# Altium schematic sheet TIDA-01576_ADS8686S_ISO_Interface_Pg8-Hardware.SchDoc
size 431 x 279 mm; Date: Not shown in title block; ApprovedBy: Not shown in title block; CheckedBy: Not shown in title block; Author: Not shown in title block; CompanyName: Not shown in title block; Engineer: Not shown in title block; Organization: Not shown in title block; Address1: Not shown in title block; Address2: Not shown in title block; Address3: Not shown in title block; Address4: Not shown in title block; DocumentNumber: 1; Revision: Use project parameter SCH_Rev; SheetNumber: 8; SheetTotal: 8; PageSetup: Record=PageOptions|CenterHorizontal=True|CenterVertical=True|PrintScale=1.00|XCorrection=1.00|YCorrection=1.00|PrintKind=0|BorderSize=5000000|LeftOffset=0|BottomOffset=0|Orientation=2|PaperLength=1000|PaperWidth=1000|Scale=100|PaperSource=15|PrintQuality=600|MediaType=1|DitherType=10|PaperKind=Letter|PrintScaleMode=1; CurrentTime: Not shown in title block; CurrentDate: Not shown in title block; Time: Not shown in title block; DocumentFullPathAndName: Not shown in title block; DocumentName: Not shown in title block; ModifiedDate: Not shown in title block; ImagePath: Not shown in title block
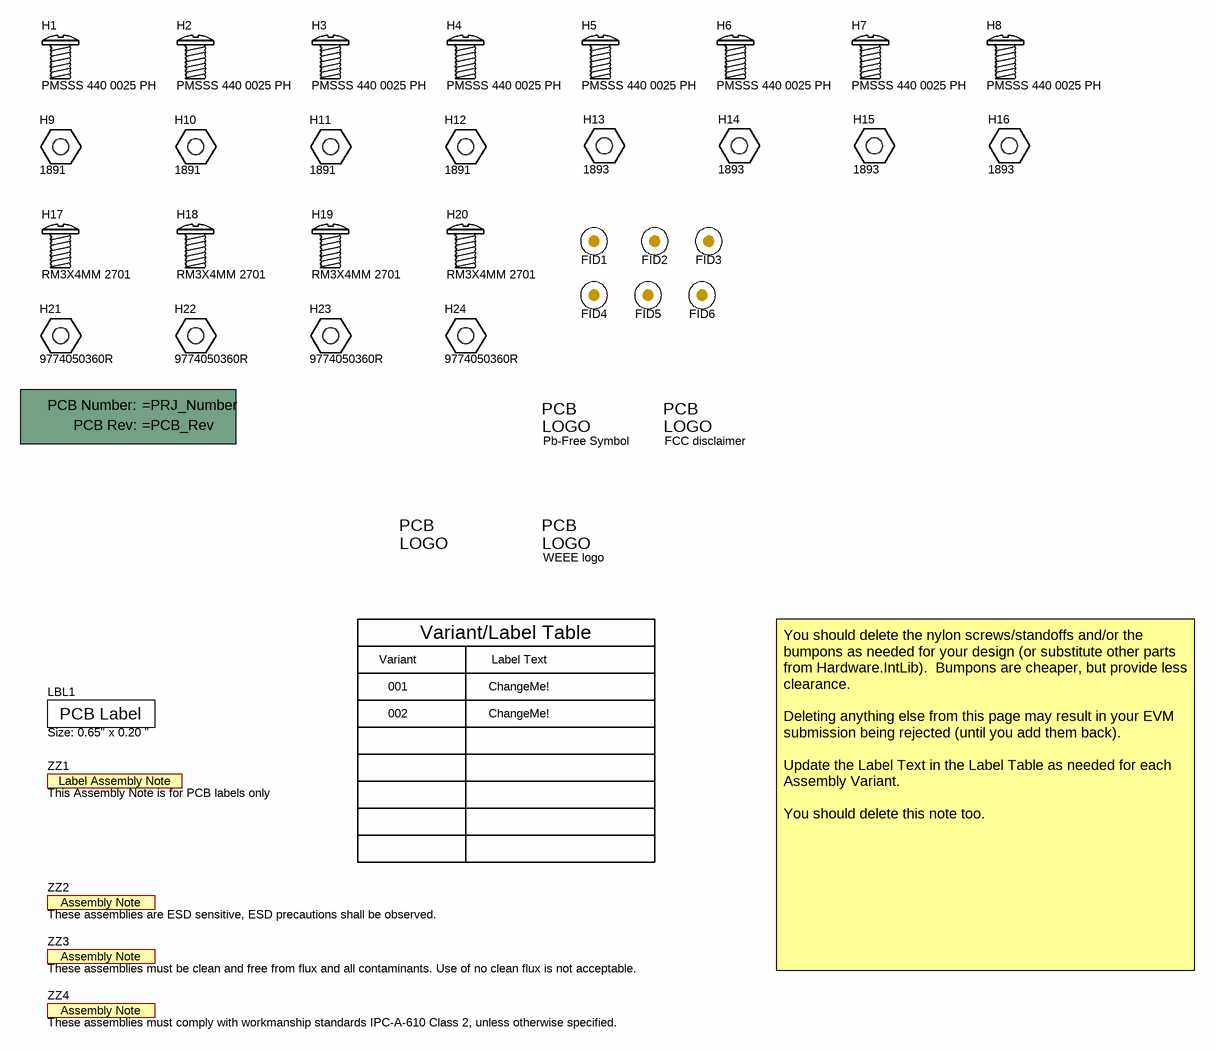
[diagram p0: TIDA-01576_ADS8686S_ISO_Interface_Pg8-Hardware.SchDoc]

## Parts
!PCB1  Printed Circuit Board  (value not drawn)  (mechanical)
FID1  Fiducial  [Fiducial10-20]  (value not drawn)  (no BOM)
FID2  Fiducial  [Fiducial10-20]  (value not drawn)  (no BOM)
FID3  Fiducial  [Fiducial10-20]  (value not drawn)  (no BOM)
FID4  Fiducial  [Fiducial10-20]  (value not drawn)  (no BOM)
FID5  Fiducial  [Fiducial10-20]  (value not drawn)  (no BOM)
FID6  Fiducial  [Fiducial10-20]  (value not drawn)  (no BOM)
H1  PMSSS 440 0025 PH  [B_F_PMSSS4400025PH]
H2  PMSSS 440 0025 PH  [B_F_PMSSS4400025PH]
H3  PMSSS 440 0025 PH  [B_F_PMSSS4400025PH]
H4  PMSSS 440 0025 PH  [B_F_PMSSS4400025PH]
H5  PMSSS 440 0025 PH  [B_F_PMSSS4400025PH]
H6  PMSSS 440 0025 PH  [B_F_PMSSS4400025PH]
H7  PMSSS 440 0025 PH  [B_F_PMSSS4400025PH]
H8  PMSSS 440 0025 PH  [B_F_PMSSS4400025PH]
H9  1891  [Keystone_1891]
H10  1891  [Keystone_1891]
H11  1891  [Keystone_1891]
H12  1891  [Keystone_1891]
H13  1893  [Keystone_1893]
H14  1893  [Keystone_1893]
H15  1893  [Keystone_1893]
H16  1893  [Keystone_1893]
H17  RM3X4MM 2701  (mechanical)
H18  RM3X4MM 2701  (mechanical)
H19  RM3X4MM 2701  (mechanical)
H20  RM3X4MM 2701  (mechanical)
H21  9774050360R  [Wurth_WA-SMSI]
H22  9774050360R  [Wurth_WA-SMSI]
H23  9774050360R  [Wurth_WA-SMSI]
H24  9774050360R  [Wurth_WA-SMSI]
LBL1  Size: 0.65" x 0.20 "  [Label_650x200]
Logo2  Pb-Free Symbol  [Pb-Free_Overlay_Small]  (no BOM)
Logo3  FCC disclaimer  [FCC_disclaimer]  (no BOM)
Logo4  WEEE logo  [WEEE_Minimum]  (no BOM)
Logo5  ESD Susceptible  [ESD_Overlay_small]  (value not drawn)  (no BOM)
ZZ1  This Assembly Note is for PCB labels only  [AssemblyNoteLabel]  (no BOM)
ZZ2  These assemblies are ESD sensitive, ESD precautions shall be observed.  [AssemblyNote]  (no BOM)
ZZ3  These assemblies must be clean and free from flux and all contaminants. Use of no clean flux is not acceptable.  [AssemblyNote]  (no BOM)
ZZ4  These assemblies must comply with workmanship standards IPC-A-610 Class 2, unless otherwise specified.  [AssemblyNote]  (no BOM)

## Notes on the sheet
- Variant
- Variant/Label Table
- Label Text
- 001
- 002
- ChangeMe!
- You should delete the nylon screws/standoffs and/or the bumpons as needed for your design (or substitute other parts from Hardware.IntLib).  Bumpons are cheaper, but provide less clearance.
  Deleting anything else from this page may result in your EVM submission being rejected (until you add them back).
  Update the Label Text in the Label Table as needed for each Assembly Variant.
  You should delete this note too.
- Drawn By:
- SVN Rev:
- Number:
- TID #:
- Orderable:
- Rev:
- Sheet Title:
- File:
- Project Title:
- Designed for:
- Assembly Variant:
- Mod. Date:
- Sheet:
- Size:
- of
- B
- http://www.ti.com
- Texas Instruments and/or its licensors do not warrant the accuracy or completeness of this specification or any information contained therein. Texas Instruments and/or its licensors do not warrant that this design will meet the specifications, will be suitable for your application or fit for any particular purpose, or will operate in an implementation. Texas Instruments and/or its licensors do not warrant that the design is production worthy. You should completely validate and test your design implementation to confirm the system functionality for your application.
- Engineer:
- Contact:
- © Texas Instruments
- (in symbol AssemblyNote) Assembly Note
- (in symbol AssemblyNoteLabel) Label Assembly Note
- (in symbol CMP-0074769-1) PCB; LOGO
- (in symbol ESD_Susceptible) PCB; LOGO
- (in symbol FCC_disclaimer) PCB; LOGO
- (in symbol Pb-Free) PCB; LOGO
- (in symbol PCB) PCB Number:; PCB Rev:
- (in symbol THT-14-423-10) PCB Label

## Library data of the parts
!PCB1 = PCB: Manufacturer: Any; SymbolCreator: a0412235; SymbolVersion: 2012-05-30; CompType: PCB; PartNumber: =PRJ_Number; RoHS: O; MountType: N/A; Publisher: Texas Instruments; LatestRevisionDate: 2012-06-27; LatestRevisionNote: Initial Version; Alternate Manufacturer: -; Alternate PartNumber: -
FID1-FID6 = Fiducial: Fiducial mark.  There is nothing to buy or mount.; SymbolCreator: codlsc; SymbolVersion: 2009-11-4; CompType: Fiducial; Publisher: Texas Instruments; LatestRevisionDate: 2015-06-01; LatestRevisionNote: Added Alternate PartNumber and Alternate Manufacturer parameters to appropriate components.; Manufacturer: N/A; MountType: N/A; PackageReference: N/A; PartNumber: N/A; ClassName: FiducialMark
H1-H8 = PMSSS 440 0025 PH: MACHINE SCREW PAN PHILLIPS 4-40; Manufacturer: B&F Fastener Supply; SymbolCreator: a0412235; CompType: Standoff; SymbolVersion: 2013-06-24; PartNumber: PMSSS 440 0025 PH; RoHS: Y; PackageReference: Machine Screw, 4-40, 1/4"; MountType: TH; ComponentLink1Description: Datasheet Link; ComponentLink1URL: http://www.fasnetdirect.com/refguide/Machinepancombo.pdf; Publisher: Texas Instruments; LatestRevisionDate: 2015-08-24; Supplier 1: Digi-Key; Supplier Part Number 1: H703-ND
H9-H12 = 1891: 3/16 Hex Female Standoff; Manufacturer: Keystone; SymbolCreator: a0412235; SymbolVersion: 2013-06-24; CompType: Standoff; PartNumber: 1891; RoHS: Y; PackageReference: 3/16 Hex Female Standoff; MountType: N/A; ComponentLink1Description: Datasheet Link; ComponentLink1URL: http://www.keyelco.com/product-pdf.cfm?p=4272; Publisher: Texas Instruments; LatestRevisionDate: 2015-08-24; Supplier 1: Digi-Key; Supplier Part Number 1: 36-1891-ND; Supplier 2: Mouser; Supplier Part Number 2: 534-1891; Supplier 3: Farnell; Supplier Part Number 3: 1226570
H13-H16 = 1893: HEX STANDOFF 4-40 ALUMINUM 1/2"; Manufacturer: Keystone; SymbolCreator: a0412235; SymbolVersion: 2013-06-24; CompType: Standoff; PartNumber: 1893; RoHS: Y; PackageReference: 4-40 HEX Aluminum standoff 0.500 inches; MountType: N/A; ComponentLink1Description: Datasheet Link; ComponentLink1URL: http://keyelco.com/userAssets/file/M65p75.pdf; Publisher: Texas Instruments; LatestRevisionDate: 2017-05-23; Supplier 1: Digi-Key; Supplier Part Number 1: 36-1893-ND; Supplier 2: Newark; Supplier Part Number 2: 01M9948; Supplier 3: Mouser; Supplier Part Number 3: 534-1893
H17-H20 = RM3X4MM 2701: Machine Screw Pan PHILLIPS M3; Manufacturer: APM HEXSEAL; SymbolCreator: a0412235; CompType: Standoff; SymbolVersion: 2013-11-25; PartNumber: RM3X4MM 2701; RoHS: Y; MountType: N/A; ComponentLink1Description: Datasheet Link; ComponentLink1URL: http://www.apmhexseal.com/wp-content/uploads/2014/05/RM.pdf; Publisher: Texas Instruments; LatestRevisionDate: 2015-08-24; Supplier 1: Digi-Key; Supplier Part Number 1: 335-1150-ND
H21-H24 = 9774050360R: ROUND STANDOFF M3 STEEL 5MM; Manufacturer: Wurth Elektronik; SymbolCreator: a0412235; SymbolVersion: 2013-06-24; CompType: Standoff; PartNumber: 9774050360R; RoHS: Y; PackageReference: ROUND STANDOFF M3 STEEL 5MM; MountType: SMT; ComponentLink1Description: Datasheet Link; ComponentLink1URL: http://katalog.we-online.de/em/datasheet/9774050360R.pdf; Publisher: Texas Instruments; LatestRevisionDate: 2015-08-24; Supplier 1: Digi-Key; Supplier Part Number 1: 732-5272-1-ND; Supplier 2: Mouser; Supplier Part Number 2: 710-9774050360R; Supplier 3: Farnell; Supplier Part Number 3: 2438004
LBL1 = THT-14-423-10: Thermal Transfer Printable Labels, 0.650" W x 0.200" H - 10,000 per roll; Manufacturer: Brady; SymbolCreator: a0412235; CompType: Label; SymbolVersion: 2012-06-12; ClassName: Label; PartNumber: THT-14-423-10; RoHS: Y; PackageReference: PCB Label 0.650"H x 0.200"W; MountType: N/A; ComponentLink1Description: Web Page; ComponentLink1URL: http://www.bradyid.com/bradyid/pdpv/THT-14-423-10.html; Note: Size: 0.65" x 0.20 "; Publisher: Texas Instruments; LatestRevisionDate: 2012-07-31; LatestRevisionNote: Initial Version; Alternate Manufacturer: -; Alternate PartNumber: -; Supplier 1: Farnell; Supplier Part Number 1: 2065596; Supplier 2: Newark; Supplier Part Number 2: 97C5133
Logo2 = Pb-Free: SymbolCreator: a0412235; SymbolVersion: 2011-08-22; Published: 2009-03-03; Publisher: Texas Instruments; LatestRevisionDate: 2014-08-05
Logo3 = FCC_disclaimer: SymbolCreator: codlsc; SymbolVersion: 2011-08-22; Published: 2009-03-03; Publisher: Texas Instruments; LatestRevisionDate: 2014-11-20
Logo4 = CMP-0074769-1: Library Reference: WEEE logo; Lib Reference: WEEE logo; PartNumber: WEEE logo
Logo5 = ESD_Susceptible: ESD Susceptible Symbol; SymbolCreator: a0412235; SymbolVersion: 2011-08-22; Published: 2009-03-03; Publisher: Texas Instruments; LatestRevisionDate: 2016-03-21
ZZ1 = AssemblyNoteLabel: SymbolCreator: a0412235; SymbolVersion: 2012-06-14; CompType: AssemblyNote; ClassName: AssemblyNote; Publisher: Texas Instruments; LatestRevisionDate: 2012-07-31; LatestRevisionNote: Initial Version; Alternate Manufacturer: -; Alternate PartNumber: -
ZZ2-ZZ4 = AssemblyNote: SymbolCreator: codlsc; SymbolVersion: 2010-05-18; CompType: AssemblyNote; ClassName: AssemblyNote; Publisher: Texas Instruments; LatestRevisionDate: 2012-06-14; LatestRevisionNote: Initial Version; Alternate Manufacturer: -; Alternate PartNumber: -